# EAGLE design SparkFun_Qwiic_Buzzer (EAGLE 9.6.2)
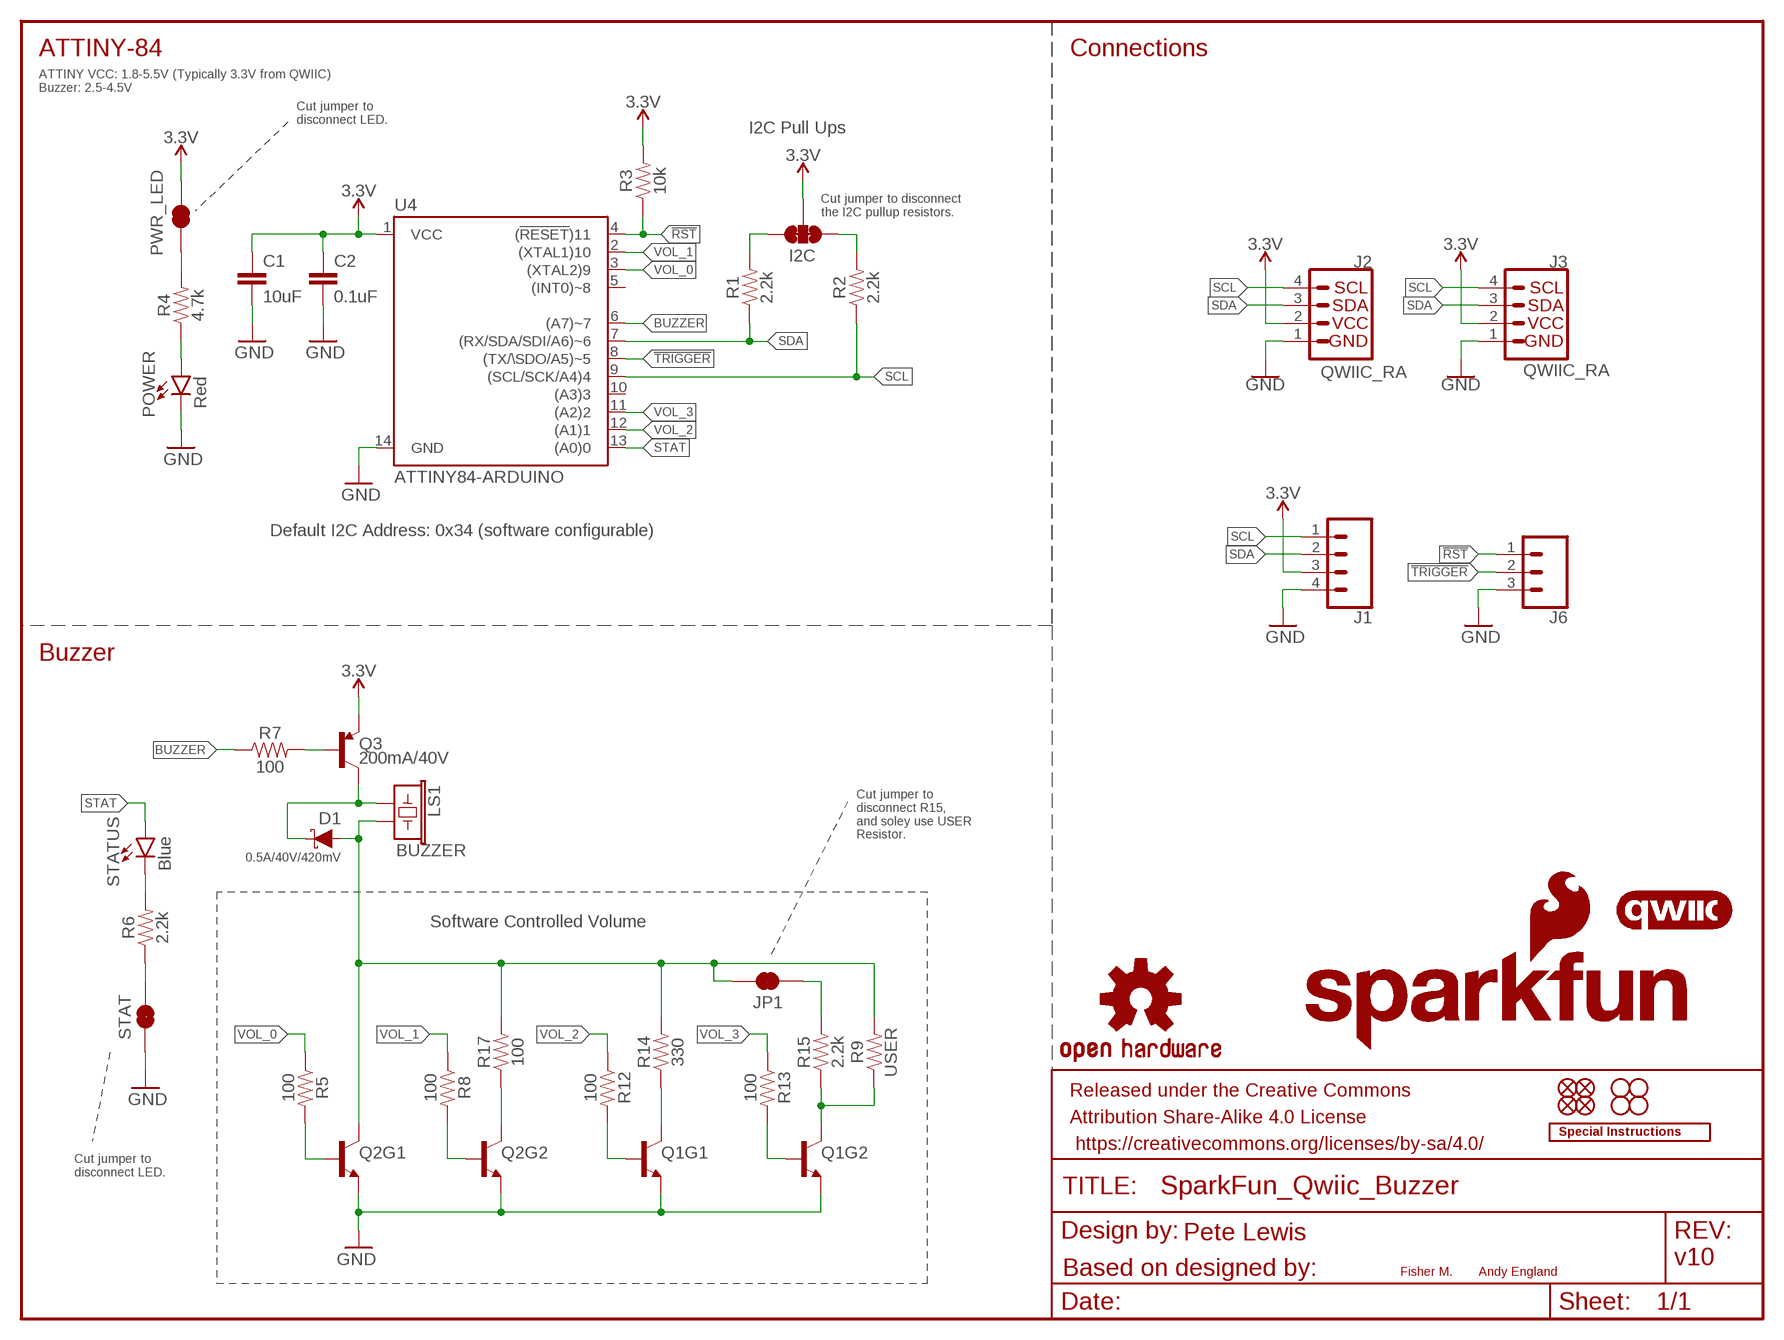
[diagram p0: schematic, sheet 1]

## Parts
C1  10uF  10UF-0402T-6.3V-20%  [0402-TIGHT]
C2  0.1uF  0.1UF-0402T-16V-10%  [0402-TIGHT]
D1  0.5A/40V/420mV  DIODE-SCHOTTKY-PMEG4005EJ  [SOD-323]
FRAME1  FRAME-LETTER  [CREATIVE_COMMONS]
H1  STAND-OFF  [STAND-OFF]
H2  STAND-OFF  [STAND-OFF]
H3  STAND-OFF  [STAND-OFF]
H4  STAND-OFF  [STAND-OFF]
I2C  JUMPER-SMT_3_2-NC_TRACE_SILK  [SMT-JUMPER_3_2-NC_TRACE_SILK]
J1  CONN_041X04_NO_SILK  [1X04_NO_SILK]
J2  QWIIC_RA  QWIIC_CONNECTORJS-1MM  [JST04_1MM_RA]
J3  QWIIC_RA  QWIIC_CONNECTORJS-1MM  [JST04_1MM_RA]
J6  CONN_031X03_NO_SILK  [1X03_NO_SILK]
JP1  JUMPER-SMT_2_NC_TRACE_SILK  [SMT-JUMPER_2_NC_TRACE_SILK]
JP2  FIDUCIALUFIDUCIAL  [FIDUCIAL-MICRO]
JP6  FIDUCIALUFIDUCIAL  [FIDUCIAL-MICRO]
JP8  FIDUCIALUFIDUCIAL  [FIDUCIAL-MICRO]
JP9  FIDUCIALUFIDUCIAL  [FIDUCIAL-MICRO]
LOGO1  OSHW-LOGOMINI  [OSHW-LOGO-MINI]
LOGO2  SFE_LOGO_NAME_FLAME.1_INCH  [SFE_LOGO_NAME_FLAME_.1]
LOGO3  SPECIAL_INSTRUCTIONS-ORDERING  [ORDERING_INSTRUCTIONS]
LOGO4  SFE_LOGO_FLAME.1_INCH  [SFE_LOGO_FLAME_.1]
LOGO5  QWIIC_LOGO_4MM  [QWIIC_4MM]
LS1  BUZZER  BUZZER-SMD  [BUZZER-CCV]
POWER  Red  LED-RED_0603-KB  [LED-0603]
PWR_LED  PWR_LED  JUMPER-SMT_2_NC_TRACE_SILK  [SMT-JUMPER_2_NC_TRACE_SILK]
Q1  TRANS_NPN_DUAL-MBT3904DW1T1  [SC70-6]
Q2  TRANS_NPN_DUAL-MBT3904DW1T1  [SC70-6]
Q3  200mA/40V  TRANS_PNP-PMBT3906|MMBT3906L  [SOT23-3]
R1  2.2k  2.2KOHM-0402T-1/16W-1%  [0402-TIGHT]
R2  2.2k  2.2KOHM-0402T-1/16W-1%  [0402-TIGHT]
R3  10k  10KOHM-0402T-1/16W-1%  [0402-TIGHT]
R4  4.7k  4.7KOHM-0402T-1/16W-1%  [0402-TIGHT]
R5  100  100OHM-0402-TIGHT-1/16W-1%  [0402-TIGHT]
R6  2.2k  2.2KOHM-0402T-1/16W-1%  [0402-TIGHT]
R7  100  100OHM-0402-TIGHT-1/16W-1%  [0402-TIGHT]
R8  100  100OHM-0402-TIGHT-1/16W-1%  [0402-TIGHT]
R9  USER  RESISTORAXIAL-0.3  [AXIAL-0.3]
R12  100  100OHM-0402-TIGHT-1/16W-1%  [0402-TIGHT]
R13  100  100OHM-0402-TIGHT-1/16W-1%  [0402-TIGHT]
R14  330  330OHM-0402T-1/16W-5%  [0402-TIGHT]
R15  2.2k  2.2KOHM-0402T-1/16W-1%  [0402-TIGHT]
R17  100  100OHM-0402-TIGHT-1/16W-1%  [0402-TIGHT]
STAT  PWR_LED  JUMPER-SMT_2_NC_TRACE_SILK  [SMT-JUMPER_2_NC_TRACE_SILK]
STATUS  Blue  LED-BLUE0603  [LED-0603]
U4  ATTINY84-ARDUINO  [SO14]

## Nets
3.3V: C1.1 C2.1 I2C.2 J1.3 J2.2 J3.2 PWR_LED.2 Q3.2(E) R3.2 U4.1(VCC)
!RST: J6.1 R3.1 U4.4((!RESET!)11)
!TRIGGER!: J6.2 U4.8((TX/\SDO/A5)~5)
BUZZER: R7.1 U4.6((A7)~7)
GND: C1.2 C2.2 J1.4 J2.1 J3.1 J6.3 POWER.C Q1.1(E) Q1.4(E) Q2.1(E) Q2.4(E) STAT.1 U4.14(GND)
N$1: PWR_LED.1 R4.2
N$2: Q2.5(B) R5.2
N$3: POWER.A R4.1
N$4: D1.A JP1.2 LS1.- Q2.3(C) R9.P$2 R14.2 R17.2
N$5: Q3.1(B) R7.2
N$6: D1.C LS1.+ Q3.3(C)
N$7: R6.2 STATUS.C
N$8: R6.1 STAT.2
N$10: Q1.2(B) R13.2
N$11: Q1.5(B) R12.2
N$12: Q2.2(B) R8.2
N$13: Q2.6(C) R17.1
N$14: Q1.3(C) R14.1
N$15: Q1.6(C) R9.P$1 R15.1
N$16: JP1.1 R15.2
SCL: J1.1 J2.4 J3.4 R2.1 U4.9((SCL/SCK/A4)4)
SCL_PU1: I2C.1 R2.2
SDA: J1.2 J2.3 J3.3 R1.1 U4.7((RX/SDA/SDI/A6)~6)
SDA_PU1: I2C.3 R1.2
STAT: STATUS.A U4.13((A0)0)
VOL_0: R5.1 U4.3((XTAL2)9)
VOL_1: R8.1 U4.2((XTAL1)10)
VOL_2: R12.1 U4.12((A1)1)
VOL_3: R13.1 U4.11((A2)2)
Unconnected: U4.5((INT0)~8) U4.10((A3)3)

## Notes on the sheet
- ATTINY-84 | Connections
- ATTINY VCC: 1.8-5.5V (Typically 3.3V from QWIIC)
  Buzzer: 2.5-4.5V
- Cut jumper to 
  disconnect LED.
- I2C Pull Ups
- Cut jumper to disconnect
  the I2C pullup resistors.
- Default I2C Address: 0x34 (software configurable)
- Buzzer
- Cut jumper to 
  disconnect R15,
  and soley use USER 
  Resistor.
- Software Controlled Volume
- Cut jumper to 
  disconnect LED.
- Pete Lewis
- v10
- Based on designed by: | Fisher M. | Andy England

## Library data of the parts
C1 = SparkFun-Capacitors:10UF: 10.0µF ceramic capacitors A capacitor is a passive two-terminal electrical component used to store electrical energy temporarily in an electric field.; PROD_ID: CAP-14848
C2 = SparkFun-Capacitors:0.1UF: 0.1µF ceramic capacitors A capacitor is a passive two-terminal electrical component used to store electrical energy temporarily in an electric field.; PROD_ID: CAP-12416
D1 = SparkFun-DiscreteSemi:DIODE-SCHOTTKY: Schottky diode A Schottky diode is a semiconductor diode which has a low forward voltage drop and a very fast switching action.; PROD_ID: DIO-10955
FRAME1 = SparkFun-Aesthetics:FRAME-LETTER: Schematic Frame - Letter Standard 8.5x11 US Letter frame
H1-H4 = SparkFun-Hardware:STAND-OFF: Stand Off Drill holes for mechanically mounting via screws, standoffs, etc. Note: Use the keepout ring to avoid running the screw head into surrounding components. Variant Overviews STAND-OFF - Mechanical footprint for a #4 phillips button head screw. STAND-OFF-TIGHT - Mechanical footprint for a #4 phillips button head screw, Example SparkFun Products Screw - Phillips Head (1/4", 4-40, 10 pack) <https://www.sparkfun.com/products/10453> (PRT-10453) Screw - Phillips Head (1/2", 4-40, 10 pack) <https://www.sparkfun.com/products/10452> (PRT-10452) Screw - Phillips Head (3/4", 4-40, 10 pack) <https://www.sparkfun.com/products/10451> (PRT-10451) Screw - Phillips Head (1", 4-40, 10 pack) <https://www.sparkfun.com/products/10450> (PRT-10450)
I2C = SparkFun-Jumpers:JUMPER-SMT_3_2-NC_TRACE: Normally closed trace jumper (2 of 2 connections) This jumper has a trace between all three pads so they are normally closed (NC). Use a razor knife to open the connection(s). For best results follow the IPC guidelines for cutting traces: Cutout at least 0.063 mm (0.005 in). Remove all loose material to clean up the cut area. Seal the cut with an approved epoxy. Reapply solder to reclose the connection(s).
J1 = SparkFun-Connectors:CONN_04: Multi connection point. Often used as Generic Header-pin footprint for 0.1 inch spaced/style header connections On any of the 0.1 inch spaced packages, you can populate with these: Break Away Headers - Straight <https://www.sparkfun.com/products/116> (PRT-00116) Break Away Male Headers - Right Angle <https://www.sparkfun.com/products/553> (PRT-00553) Female Headers <https://www.sparkfun.com/products/115> (PRT-00115) Break Away Headers - Machine Pin <https://www.sparkfun.com/products/117> (PRT-00117) Break Away Female Headers - Swiss Machine Pin <https://www.sparkfun.com/products/743> (PRT-00743) For SCREWTERMINALS and SPRING TERMINALS visit here: Screw Terimnals on SparkFun.com <https://www.sparkfun.com/search/results?term=Screw+Terminals> (5mm/3.5mm/2.54mm spacing) This device is also useful as a general connection point to wire up your design to another part of your project. Our various solder wires solder well into these plated through hole pads. Hook-Up Wire - Assortment (Stranded, 22 AWG) <https://www.sparkfun.com/products/11375> (PRT-11375) Hook-Up Wire - Assortment (Solid Core, 22 AWG) <https://www.sparkfun.com/products/11367> (PRT-11367) View the entire wire category on our website here <https://www.sparkfun.com/categories/141> Special notes: Molex polarized connector foot print use with SKU : PRT-08231 with associated crimp pins and housings. 1MM SMD Version SKU: PRT-10208
J2 J3 = SparkFun-Connectors:QWIIC_CONNECTOR: SparkFun I2C Standard Qwiic Connector An SMD 1mm pitch JST connector makes it easy and quick (get it? Qwiic?) to connect I2C devices to each other. The Qwiic system <http://www.sparkfun.com/qwiic> enables fast and solderless connection between popular platforms and various sensors and actuators. We carry 200mm <https://www.sparkfun.com/products/14204>, 100mm <https://www.sparkfun.com/products/14205>, 50mm <https://www.sparkfun.com/products/14206>, and breadboard friendly <https://www.sparkfun.com/products/14207> Qwiic cables. We also offer 10 pcs strips <https://www.sparkfun.com/products/14323> the SMD connectors.; PROD_ID: CONN-13694; VALUE: QWIIC_RIGHT_ANGLE
J6 = SparkFun-Connectors:CONN_03: Multi connection point. Often used as Generic Header-pin footprint for 0.1 inch spaced/style header connections On any of the 0.1 inch spaced packages, you can populate with these: Break Away Headers - Straight <https://www.sparkfun.com/products/116> (PRT-00116) Break Away Male Headers - Right Angle <https://www.sparkfun.com/products/553> (PRT-00553) Female Headers <https://www.sparkfun.com/products/115> (PRT-00115) Break Away Headers - Machine Pin <https://www.sparkfun.com/products/117> (PRT-00117) Break Away Female Headers - Swiss Machine Pin <https://www.sparkfun.com/products/743> (PRT-00743) Stackable Header - 3 Pin (Female, 0.1") <https://www.sparkfun.com/products/13875> (PRT-13875) For SCREWTERMINALS and SPRING TERMINALS visit here: Screw Terimnals on SparkFun.com <https://www.sparkfun.com/search/results?term=Screw+Terminals> (5mm/3.5mm/2.54mm spacing) This device is also useful as a general connection point to wire up your design to another part of your project. Our various solder wires solder well into these plated through hole pads. Hook-Up Wire - Assortment (Stranded, 22 AWG) <https://www.sparkfun.com/products/11375> (PRT-11375) Hook-Up Wire - Assortment (Solid Core, 22 AWG) <https://www.sparkfun.com/products/11367> (PRT-11367) View the entire wire category on our website here <https://www.sparkfun.com/categories/141> Special notes: Molex polarized connector foot print use with SKU : PRT-08232 with associated crimp pins and housings.
JP1 PWR_LED STAT = SparkFun-Jumpers:JUMPER-SMT_2_NC_TRACE: Normally closed trace jumper This jumper has a trace between two pads so it's normally closed (NC). Use a razor knife to open the connection. For best results follow the IPC guidelines for cutting traces: Cutout at least 0.063 mm (0.005 in). Remove all loose material to clean up the cut area. Seal the cut with an approved epoxy. Reapply solder to reclose the connection.
JP2 JP6 JP8 JP9 = SparkFun-Aesthetics:FIDUCIAL: Fiducial Alignment Points Point-of-reference for pick-and-place machines and other optical instruments.
LOGO1 = SparkFun-Aesthetics:OSHW-LOGO: Open-Source Hardware (OSHW) Logo This logo indicates the piece of hardware it is found on incorporates a OSHW license and/or adheres to the definition of open source hardware found here: http://freedomdefined.org/OSHW
LOGO2 = SparkFun-Aesthetics:SFE_LOGO_NAME_FLAME: SparkFun Font Logo w/ Flame This is the SparkFun full logo. The logo on the schematic will always be the same size; the package variant is the height of the flame part of the logo. Default layer for the logo on the board is tSilk.
LOGO3 = SparkFun-Aesthetics:SPECIAL_INSTRUCTIONS: Special Ordering/Production Instructions Alert Symbol for special PCB ordering instructions or unique production process warnings. Ordering Instructions Production Instructions Types of information that should be added to box: Copper weight Soldermask color Silk color PCB thickness Number of layers PCB Standard: 1.6mm FR4 1 oz copper immersion silver plating red soldermask white silkscreen Types of information that should be added to box: Special wash requirements Depaneling instructions Humidification Glue curing Default text settings: 0.07 inch 9% ratio 50% line distance
LOGO4 = SparkFun-Aesthetics:SFE_LOGO_FLAME: SparkFun Flame Logo This is the SparkFun flame logo. The logo on the schematic will always be the same size; the package variant is the height of the flame. Default layer for the logo on the board is tSilk.
LOGO5 = SparkFun-Aesthetics:QWIIC_LOGO: Qwiic Logos for placement on schematic and PCB. The 5.5mm silk logo is best for placing next to Qwiic connector.
LS1 = SparkFun-Electromechanical:BUZZER: Buzzer Small round buzzers that operate around the audible 2kHz range. You can use these as speakers to create simple music or user interfaces. Variant Overview: PTH - Mini Speaker - PC Mount 12mm 2.048kHz <https://www.sparkfun.com/products/7950> PTH_KIT - Mini Speaker - PC Mount 12mm 2.048kHz <https://www.sparkfun.com/products/7950> KIT simplifies soldering by adding stop mask to one side of the pads. PTH_NO_SILK - Mini Speaker - PC Mount 12mm 2.048kHz <https://www.sparkfun.com/products/7950> No silkscreen indicator of buzzer outline. PTH_KIT_NO_SILK - Mini Speaker - PC Mount 12mm 2.048kHz <https://www.sparkfun.com/products/7950> KIT package w/o silkscreen SMD - Buzzer Audio Magnetic (CCV-084B16) SMD buzzer used on, e.g. the LilyPad Buzzer <https://www.sparkfun.com/products/8463> and RFID USB Reader <https://www.sparkfun.com/products/9963>. SMD_KIT - Buzzer Audio Magnetic (CCV-084B16) SMD Buzzer with elongated pins to make soldering easier. Used on the SparkFun Simon Says - Surface Mount Soldering Kit <https://www.sparkfun.com/products/10935>. SMD-SQUARE - Buzzer Audio Magnetic (COMP-15701) SMT square buzzer with one chamfered corner.; PROD_ID: COMP-08568
POWER = SparkFun-LED:LED-RED: Red SMD LED Used in manufacturing of most products at SparkFun Packages: 0603 - KB - KingBright (DIO-17976) SMD 0603 package [Datasheet] <https://www.kingbrightusa.com/images/catalog/SPEC/APT1608SURCK.pdf> 0603 - (DIO-00819, has gone EOL) SMD 0603 package 0603 SMART - SMD 0603 SMART package ( more efficient and expensive)[Product Link] <http://www.osram-os.com/Graphics/XPic2/00077099_0.pdf> 1206 - SMD1206 package [Product Link] <https://www.sparkfun.com/datasheets/DevTools/LilyPad/Q150OVS4.pdff> SparkFun Products: Pro Mini 328 -5V <https://www.sparkfun.com/products/821> RedBoard <https://www.sparkfun.com/products/12757> IOIO-OTG <https://www.sparkfun.com/products/13613>; PROD_ID: DIO-17976
Q1 Q2 = SparkFun-DiscreteSemi:TRANS_NPN_DUAL: Dual NPN Transistors in Single Package The MBT3904W1 puts two general purpose 3904 NPN transistors in a single package. Datasheet <http://www.onsemi.com/pub_link/Collateral/MBT3904DW1T1-D.PDF> SparkFun Products: SparkFun ESP32 Thing <https://www.sparkfun.com/products/13907>; PROD_ID: TRANS-13337
Q3 = SparkFun-DiscreteSemi:TRANS_PNP: PNP transistor Current controlled devices typically used to amplify current or used as a switch. SparkFun Products: SparkFun Serial Enabled 16x2 LCD - Red on Black <https://www.sparkfun.com/products/9068> SparkFun Logomatic <https://www.sparkfun.com/products/12772>; PROD_ID: TRANS-08052
R1 R2 R6 R15 = SparkFun-Resistors:2.2KOHM: 2.2kΩ resistor A resistor is a passive two-terminal electrical component that implements electrical resistance as a circuit element. Resistors act to reduce current flow, and, at the same time, act to lower voltage levels within circuits. - Wikipedia; PROD_ID: RES-14341
R3 = SparkFun-Resistors:10KOHM: 10kΩ resistor A resistor is a passive two-terminal electrical component that implements electrical resistance as a circuit element. Resistors act to reduce current flow, and, at the same time, act to lower voltage levels within circuits. - Wikipedia; PROD_ID: RES-14241
R4 = SparkFun-Resistors:4.7KOHM: 4.7kΩ resistor A resistor is a passive two-terminal electrical component that implements electrical resistance as a circuit element. Resistors act to reduce current flow, and, at the same time, act to lower voltage levels within circuits. - Wikipedia; PROD_ID: RES-15343
R5 R7 R8 R12 R13 R17 = SparkFun-Resistors:100OHM: 100Ω resistor A resistor is a passive two-terminal electrical component that implements electrical resistance as a circuit element. Resistors act to reduce current flow, and, at the same time, act to lower voltage levels within circuits. - Wikipedia; PROD_ID: RES-14962
R9 = SparkFun-Resistors:RESISTOR: Generic Resistor Package
R14 = SparkFun-Resistors:330OHM: 330Ω resistor A resistor is a passive two-terminal electrical component that implements electrical resistance as a circuit element. Resistors act to reduce current flow, and, at the same time, act to lower voltage levels within circuits. - Wikipedia; PROD_ID: RES-15407
STATUS = SparkFun-LED:LED-BLUE: Blue SMD LED Used in manufacturing of various products at SparkFun Packages: 0603 - SMD 0603 package [Product Link] <http://www.digikey.com/product-detail/en/SMLE12BC7TT86/511-1589-2-ND/1641808> 1206 - SMD1206 package [Product Link] <http://www.digikey.com/product-detail/en/lite-on-inc/LTST-C150TBKT/160-1643-1-ND/573584> SparkFun Products: ESP8266 Thing-Dev Board <https://www.sparkfun.com/products/13711> RedBoard <https://www.sparkfun.com/products/12757>; PROD_ID: DIO-08575
U4 = SparkFun-IC-Microcontroller:ATTINY84-ARDUINO; PROD_ID: IC-14155

## Board
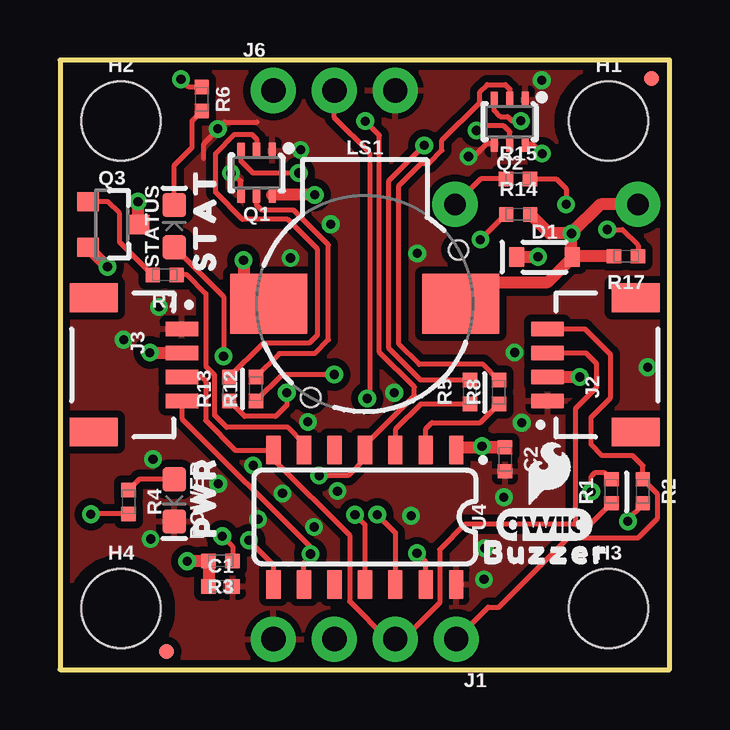
[diagram p1: board, top side]
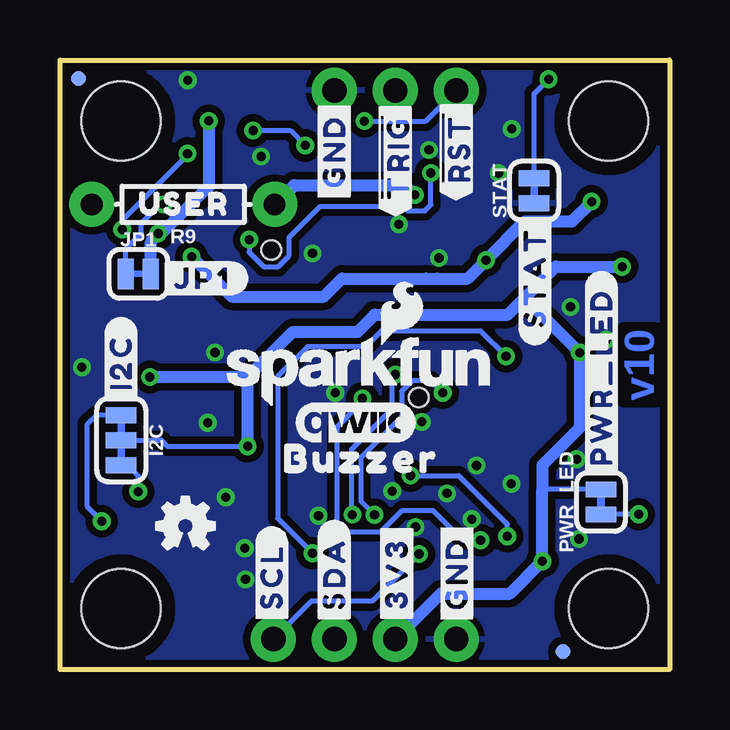
[diagram p2: board, bottom side, seen from below]

Size 25.4 x 25.4 mm. Coordinates in mm from the lower left corner, seen from the top.
Outline: 0,0 25.4,0 25.4,25.4 0,25.4 0,0
Copper layers (1*16): Top 0.035mm / dielectric 1.5mm / Bottom 0.035mm
Design rules "SparkFun-2-layer-TIGHT": minimum track width 7mil, minimum drill 15mil, track to track 7mil, track to pad 7mil, pad to pad 7mil, via to via 7mil, smd to smd 7mil, copper to edge 7mil, drill to drill 7mil, minimum pad ring 7mil, minimum via ring 7mil, stop-mask expansion 4mil, vias tented up to drill 25mil, thermal gap 10mil

### Footprints (pad centres in the part's own frame; a part is rotated, then mirrored left to right if it is on the bottom)
0402-TIGHT = smd 0.6 x 0.6: 1 -0.5,0; 2 0.5,0
SOD-323 = smd 0.63 x 0.83: A 1.15,0; C -1.15,0
STAND-OFF = hole 3.302: 0,0
SMT-JUMPER_3_2-NC_TRACE_SILK = smd 0.66 x 1.27: 1 -1.041,0; 2 0,0; 3 1.041,0
1X04_NO_SILK = drill 1.016 pad 1.88: 1 0,0; 2 2.54,0; 3 5.08,0; 4 7.62,0
JST04_1MM_RA = smd 0.6 x 1.35: 1 -1.5,0; 2 -0.5,0; 3 0.5,0; 4 1.5,0 | smd 1.2 x 2: NC1 2.8,-3.675; NC2 -2.8,-3.675
1X03_NO_SILK = drill 1.016 pad 1.88: 1 0,0; 2 2.54,0; 3 5.08,0
SMT-JUMPER_2_NC_TRACE_SILK = smd 0.66 x 1.27: 1 -0.521,0; 2 0.521,0
FIDUCIAL-MICRO = smd 0.635 x 0.635: 1 0,0
BUZZER-CCV = smd 3.2 x 2.5: + 4,0; - -4,0 | hole 0.8: -3.9,-2.25; 2.25,3.9
LED-0603 = smd 1 x 1: A -0.877,0; C 0.877,0
SC70-6 = smd 0.3 x 0.66: 1 -0.65,-0.92; 2 0,-0.92; 3 0.65,-0.92; 4 0.65,0.92; 5 0,0.92; 6 -0.65,0.92
SOT23-3 = smd 0.8 x 0.9: 1 -0.95,-1; 2 0.95,-1; 3 0,1.1
AXIAL-0.3 = drill 0.9 pad 1.88: P$1 -3.81,0; P$2 3.81,0
SO14 = smd 0.6 x 1.2: 1 -3.81,-2.8; 2 -2.54,-2.8; 3 -1.27,-2.8; 4 0,-2.8; 5 1.27,-2.8; 6 2.54,-2.8; 7 3.81,-2.8; 8 3.81,2.8; 9 2.54,2.8; 10 1.27,2.8; 11 0,2.8; 12 -1.27,2.8; 13 -2.54,2.8; 14 -3.81,2.8

### Placement (x,y rotation side)
C1  6.69,3.46 0 top
C2  18.54,8.76 270 top
D1  20.19,17.19 0 top
FRAME1  74.93,-8.89 0 top  (outside the outline)
H1  22.86,22.86 0 top
H2  2.54,22.86 0 top
H3  22.86,2.54 0 top
H4  2.54,2.54 0 top
I2C  22.85,9.56 270 bottom
J1  16.51,1.27 180 top
J2  20.32,12.7 90 top
J3  5.08,12.7 270 top
J6  8.89,24.13 0 top
JP1  22.14,16.49 0 bottom
JP2  24.64,24.64 0 bottom
JP6  4.45,0.76 0 bottom
JP8  4.45,0.76 0 top
JP9  24.64,24.64 0 top
LOGO1  20.18,5.99 0 bottom
LOGO2  12.89,12.45 0 bottom
LOGO3  57.15,52.07 0 top  (outside the outline)
LOGO4  20.38,8.19 0 top
LOGO5  20.19,6.03 0 top
LS1  12.7,15.24 180 top
POWER  4.76,7.05 270 top
PWR_LED  2.86,6.99 90 bottom
Q1  8.19,20.7 180 top
Q2  18.74,22.83 180 top
Q3  2.16,18.54 270 top
R1  22.98,7.43 90 top
R2  24.28,7.43 270 top
R3  6.69,4.53 180 top
R4  2.86,6.99 270 top
R5  17.08,11.56 90 top
R6  5.91,23.77 270 top
R7  4.37,16.44 180 top
R8  18.29,11.56 90 top
R9  20.27,19.38 180 bottom
R12  8.16,11.69 90 top
R13  7.05,11.69 90 top
R14  19.09,18.97 0 top
R15  19.09,20.45 0 top
R17  23.58,17.22 180 top
STAT  5.64,19.95 90 bottom
STATUS  4.76,18.48 90 top
U4  12.7,6.35 180 top
U$1  [STAT0]  6.03,18.73 90 top
U$2  [#GND#0]  8.86,4.01 90 bottom
U$5  [#PWR_LED#13]  2.84,12.18 90 bottom
U$6  [#JP1#14]  19.47,16.3 0 bottom
U$7  [#STAT#3]  5.61,16.35 90 bottom
U$8  [USER12]  20.24,19.4 0 bottom
U$9  [PWR0]  6.03,7.18 90 top
U$10  [#GND#0]  13.97,21.59 90 bottom
U$11  [#I2C#0]  22.86,12.79 90 bottom
U$12  [##RST##7]  8.89,21.72 90 bottom
U$13  [BUZZER1]  20.26,4.89 0 top
U$15  [##TRIG##6]  11.43,21.34 90 bottom
U$16  [QWIIC_5MM]  13.11,10.31 0 bottom
U$17  [#3V3#0]  11.37,4 90 bottom
U$18  [#SCL#0]  16.57,3.87 90 bottom
U$19  [#SDA#0]  13.97,4 90 bottom
U$22  [BUZZER14]  12.85,8.8 0 bottom

### Tracks (layer width: path | path; a pad name or v marks a point on that pad's centre or on a via)
3.3V  (via drill 0.38)
  Top 0.203: R3.2 6.17,4.51
  Top 0.508: J2.2 v21.64,12.2 v21.65,12.19 | v3.75,13.21 J3.2 | U4.1 16.62,9.26 C2.1 17.62,9.26 v17.58,9.3 | Q3.2 1.96,16.79 v1.98,16.79 | 6.17,4.51 v5.3,4.51 | R3.2 C1.1
  Bottom 0.203: PWR_LED.2 5.3,7.51 | I2C.2 21.18,9.56 20.92,9.3 v17.58,9.3
  Bottom 0.508: v21.65,12.19 17.58,12.19 | v17.58,9.3 17.58,12.19 | J1.3 9.53,3.17 6.64,3.17 v5.3,4.51 5.3,7.51 5.3,8.52 3.75,10.08 v3.75,13.21 6.03,15.49 | v1.98,16.79 4.74,16.79 6.03,15.49 | 17.58,12.19 15.7,14.08 13,14.08 12.29,14.79 6.74,14.79 6.03,15.49
!RST  (via drill 0.38)
  Top 0.203: v10.8,8.09 12.01,8.09 12.7,8.78 U4.4 12.7,9.36 14.76,11.42 14.76,11.78 13.31,13.23 13.31,22.26 v12.72,22.85 | v6.76,5.56 7.19,5.13 R3.1
  Bottom 0.203: v10.8,8.09 8.79,8.09 6.76,6.06 v6.76,5.56 | J6.1 10.17,22.85 v12.72,22.85 | v6.76,5.56
!TRIGGER!  (via drill 0.38)
  Top 0.203: J6.2 11.43,23 12.9,21.53 12.9,11.39 v12.8,11.29 | v7.88,5.39 7.88,5.38 8.89,4.36 U4.8
  Bottom 0.203: v7.88,5.39 8.62,5.39 9.86,6.63 11.14,6.63 12.03,5.74 13.63,5.74 13.88,5.98 13.88,10.1 12.8,11.18 v12.8,11.29
BUZZER
  Top 0.203: U4.6 10.16,9.44 9.5,10.09 6.95,10.09 6.45,10.59 6.45,12.27 6.08,12.64 6.08,15.66 5.29,16.44 R7.1
GND  (via drill 0.38)
  Top 0.203: Q1.4 7.54,20.36 7.21,20.69 v7.13,20.69 | 5.98,21.29 5.98,21.88 6.6,22.51 v6.58,22.53 6.86,22.81 8.2,22.81 | Q2.4 17.78,21.91 17.25,21.38 v17.02,21.38
  other vias: 17.7,5.06 19.24,10.29 4.13,15.11 8.25,6.27 13.93,11.54 10.59,5.94 9.27,7.34 10.03,21.65 20.07,24.55 24.49,12.6 18.94,13.21 2.65,13.74 6.59,7.74 3.87,8.77 3.78,5.44 14.88,17.34 9.61,17.15 11.28,18.56 18.5,7.18 14.63,6.41 17.67,3.76 11.56,7.44 8.05,8.5 10.33,10.32
  pour Top (isolate 0.305): 0,0 0,25.4 25.4,25.4 25.4,0
  pour Bottom (isolate 0.305): 0,0 25.4,0 25.4,25.4 0,25.4
N$1  (via drill 0.38)
  Top 0.203: R4.2 1.3,6.49 v1.28,6.47
  Bottom 0.203: v1.28,6.47 2.85,6.47 PWR_LED.1
N$2  (via drill 0.38)
  Top 0.203: R5.2 15.03,12.06 13.71,13.39 13.71,20.37 v15.18,21.84 | Q2.5 18.74,22.41 18.49,22.66 17.55,22.66 v17.35,22.46
  Bottom 0.203: v17.35,22.46 15.81,22.46 15.19,21.84 v15.18,21.84
N$3
  Top 0.203: POWER.A 3.3,7.93 R4.1
N$4  (via drill 0.38)
  Top 0.203: Q2.3 18.09,23.3 18.35,23.04 18.65,23.04 18.82,22.86 v19.2,22.86
  Top 0.508: LS1.- 17.6,16.14 20.32,16.14 21.34,17.16 D1.A | R9.P$2 22.52,19.38 v21.31,18.17 | R17.2 21.37,17.22 D1.A | D1.A 21.31,17.22 v21.31,18.17 | R14.2 20.39,18.17 v21.31,18.17
  Bottom 0.508: v19.2,22.86 19.2,20.14 21.17,18.17 v21.31,18.17 21.31,18.13 21.62,17.82 JP1.2
N$5
  Top 0.203: R7.2 3.85,16.44 2.48,17.81 2.48,19 2,19.49 Q3.1
N$6  (via drill 0.38)
  Top 0.508: v19.92,17.2 19.9,17.19 D1.C | v7.65,17.06 | v7.65,17.06 7.65,16.29 LS1.+ | v3.25,19.5 3.25,18.55 Q3.3
  Bottom 0.508: v19.92,17.2 18.25,15.54 14.41,15.54 13.66,16.29 10.16,16.29 9.67,16.29 8.42,16.29 v7.65,17.06 6.04,18.67 4.07,18.67 v3.25,19.5
N$7
  Top 0.203: STATUS.C 4.76,21.02 5.5,21.76 5.5,22.86 R6.2
N$8  (via drill 0.38)
  Top 0.203: R6.1 5.37,24.27 v5.04,24.6
  Bottom 0.203: v5.04,24.6 5.64,23.99 5.64,23.73 STAT.2 | STAT.2
N$10
  Top 0.203: R13.2 8.49,13.63 10.42,13.63 10.73,13.94 10.73,17.51 9.48,18.76 7.6,18.76 6.48,19.88 6.48,21.5 7.27,22.3 7.99,22.3 8.19,22.1 Q1.2
N$11
  Top 0.203: R12.2 9.13,13.16 10.61,13.16 11.18,13.74 11.18,17.7 9.73,19.15 8.4,19.15 8.19,19.36 Q1.5
N$12
  Top 0.203: R8.2 17.63,12.72 14.96,12.72 14.12,13.56 14.12,20.17 15.06,21.11 15.39,21.11 15.92,21.63 15.92,22.05 17.5,23.63 17.5,24.07 17.8,24.37 18.56,24.37 18.74,24.19 Q2.2
N$13  (via drill 0.38)
  Top 0.203: Q2.6 19.68,21.91 v20.09,21.5 | v22.8,18.34 23.43,18.34 24.08,17.68 R17.1
  Bottom 0.203: v22.8,18.34 22.8,18.72 20.09,21.43 v20.09,21.5
N$14  (via drill 0.38)
  Top 0.203: Q1.3 7.54,21.2 8.05,20.69 v9.95,20.69 | v17.52,17.92 18.57,18.97 R14.1
  Bottom 0.203: v17.52,17.92 17.52,17.4 16.91,16.79 16.3,16.79 15.85,17.24 15.85,18.01 14.56,19.3 11.1,19.3 10.91,19.12 10.19,19.12 9.95,19.36 v9.95,20.69
N$15  (via drill 0.38)
  Top 0.203: R15.1 17.52,20.45 R9.P$1 | Q1.6
  Top 0.508: v10.62,19.78 Q1.6
  Bottom 0.508: R9.P$1 15.65,20.19 11.03,20.19 v10.62,19.78
N$16  (via drill 0.38)
  Top 0.203: R15.2 20.67,20.45 21.09,20.03 v21.09,19.38
  Bottom 0.203: JP1.1 22.66,17.54 22.01,18.19 22.01,18.59 21.22,19.38 v21.09,19.38
SCL  (via drill 0.38)
  Top 0.203: J3.4 5.08,10.46 10.44,5.1 v10.44,4.82 10.44,4.72 10.16,4.44 U4.9 | J2.4 21.87,14.2 22.92,13.14 22.92,11.3 22.13,10.51 22.13,9.38 22.59,8.92 23.86,8.92 24.28,8.5 R2.1 24.88,7.33 24.88,6.29 24.08,5.49 21.18,5.49 18.29,2.6 17.84,2.6 J1.1
  Bottom 0.203: J1.1 14.92,2.86 12.4,2.86 v10.44,4.82
SCL_PU1  (via drill 0.38)
  Top 0.203: R2.2 24.28,6.86 23.66,6.23 v23.66,6.18
  Bottom 0.203: v23.66,6.18 24.26,6.78 24.26,10.23 23.89,10.6 I2C.1
SDA
  Top 0.203: J3.3 5.9,12.2 6.07,12.03 6.07,10.38 7.3,9.15 U4.7 8.89,8.76 12.06,5.59 12.06,2.85 13.64,1.27 J1.2 14.31,1.27 15.82,2.78 15.82,5 16.87,6.05 21.49,6.05 | J2.3 21.92,13.2 22.35,12.76 22.35,11.75 21.48,10.87 21.48,6.06 21.49,6.05 | R1.1 22.1,6.05 21.49,6.05
SDA_PU1  (via drill 0.38)
  Top 0.203: R1.2 22.96,7.93 22.69,8.2 22.29,8.2 22.14,8.05 v22.14,7.41
  Bottom 0.203: v22.14,7.41 22.14,8.07 22.59,8.52 I2C.3
STAT  (via drill 0.38)
  Top 0.203: v6.82,13.05 v6.82,13.06 6.82,15.54 STATUS.A | U4.13 15.24,4.49 v14.88,4.85
  Bottom 0.203: v14.88,4.85 16.33,6.3 16.33,12.21 15.08,13.46 12.66,13.46 12.02,14.1 7.86,14.1 v6.82,13.05
VOL_0
  Top 0.203: R5.1 15.02,11.06 13.97,10.01 U4.3
VOL_1
  Top 0.203: U4.2 15.24,10.03 15.49,10.29 17.51,10.29 R8.1
VOL_2  (via drill 0.38)
  Top 0.203: R12.1 9.26,12.29 11.42,12.29 v11.43,12.3 | v13.22,6.46 13.97,5.71 U4.12
  Bottom 0.203: v11.43,12.3 11.57,12.15 11.57,10.85 13.26,9.17 13.26,6.5 v13.22,6.46
VOL_3  (via drill 0.38)
  Top 0.203: R13.1 7.7,10.55 8.99,10.55 9.45,11.01 v9.45,11.54 | v12.29,6.45 12.7,6.04 U4.11
  Bottom 0.203: v12.29,6.45 12.86,7.02 12.86,8.84 11.16,10.54 11.16,11.59 10.72,12.04 9.95,12.04 v9.45,11.54

### Text on the board
Bottom: v10
Measures: Units in Inches
tDocu: Thickness: 1.6mm / Layers: 2 / Solder Mask Color: Red / Silkscreen: White / Finish: Lead-Free HASL / Material: TG135-140 / Copper Plating: 1oz | Pete Lewis | Based on designed by Fisher M. and Andy England